# EAGLE design mm2.0 (EAGLE 8.3.2)
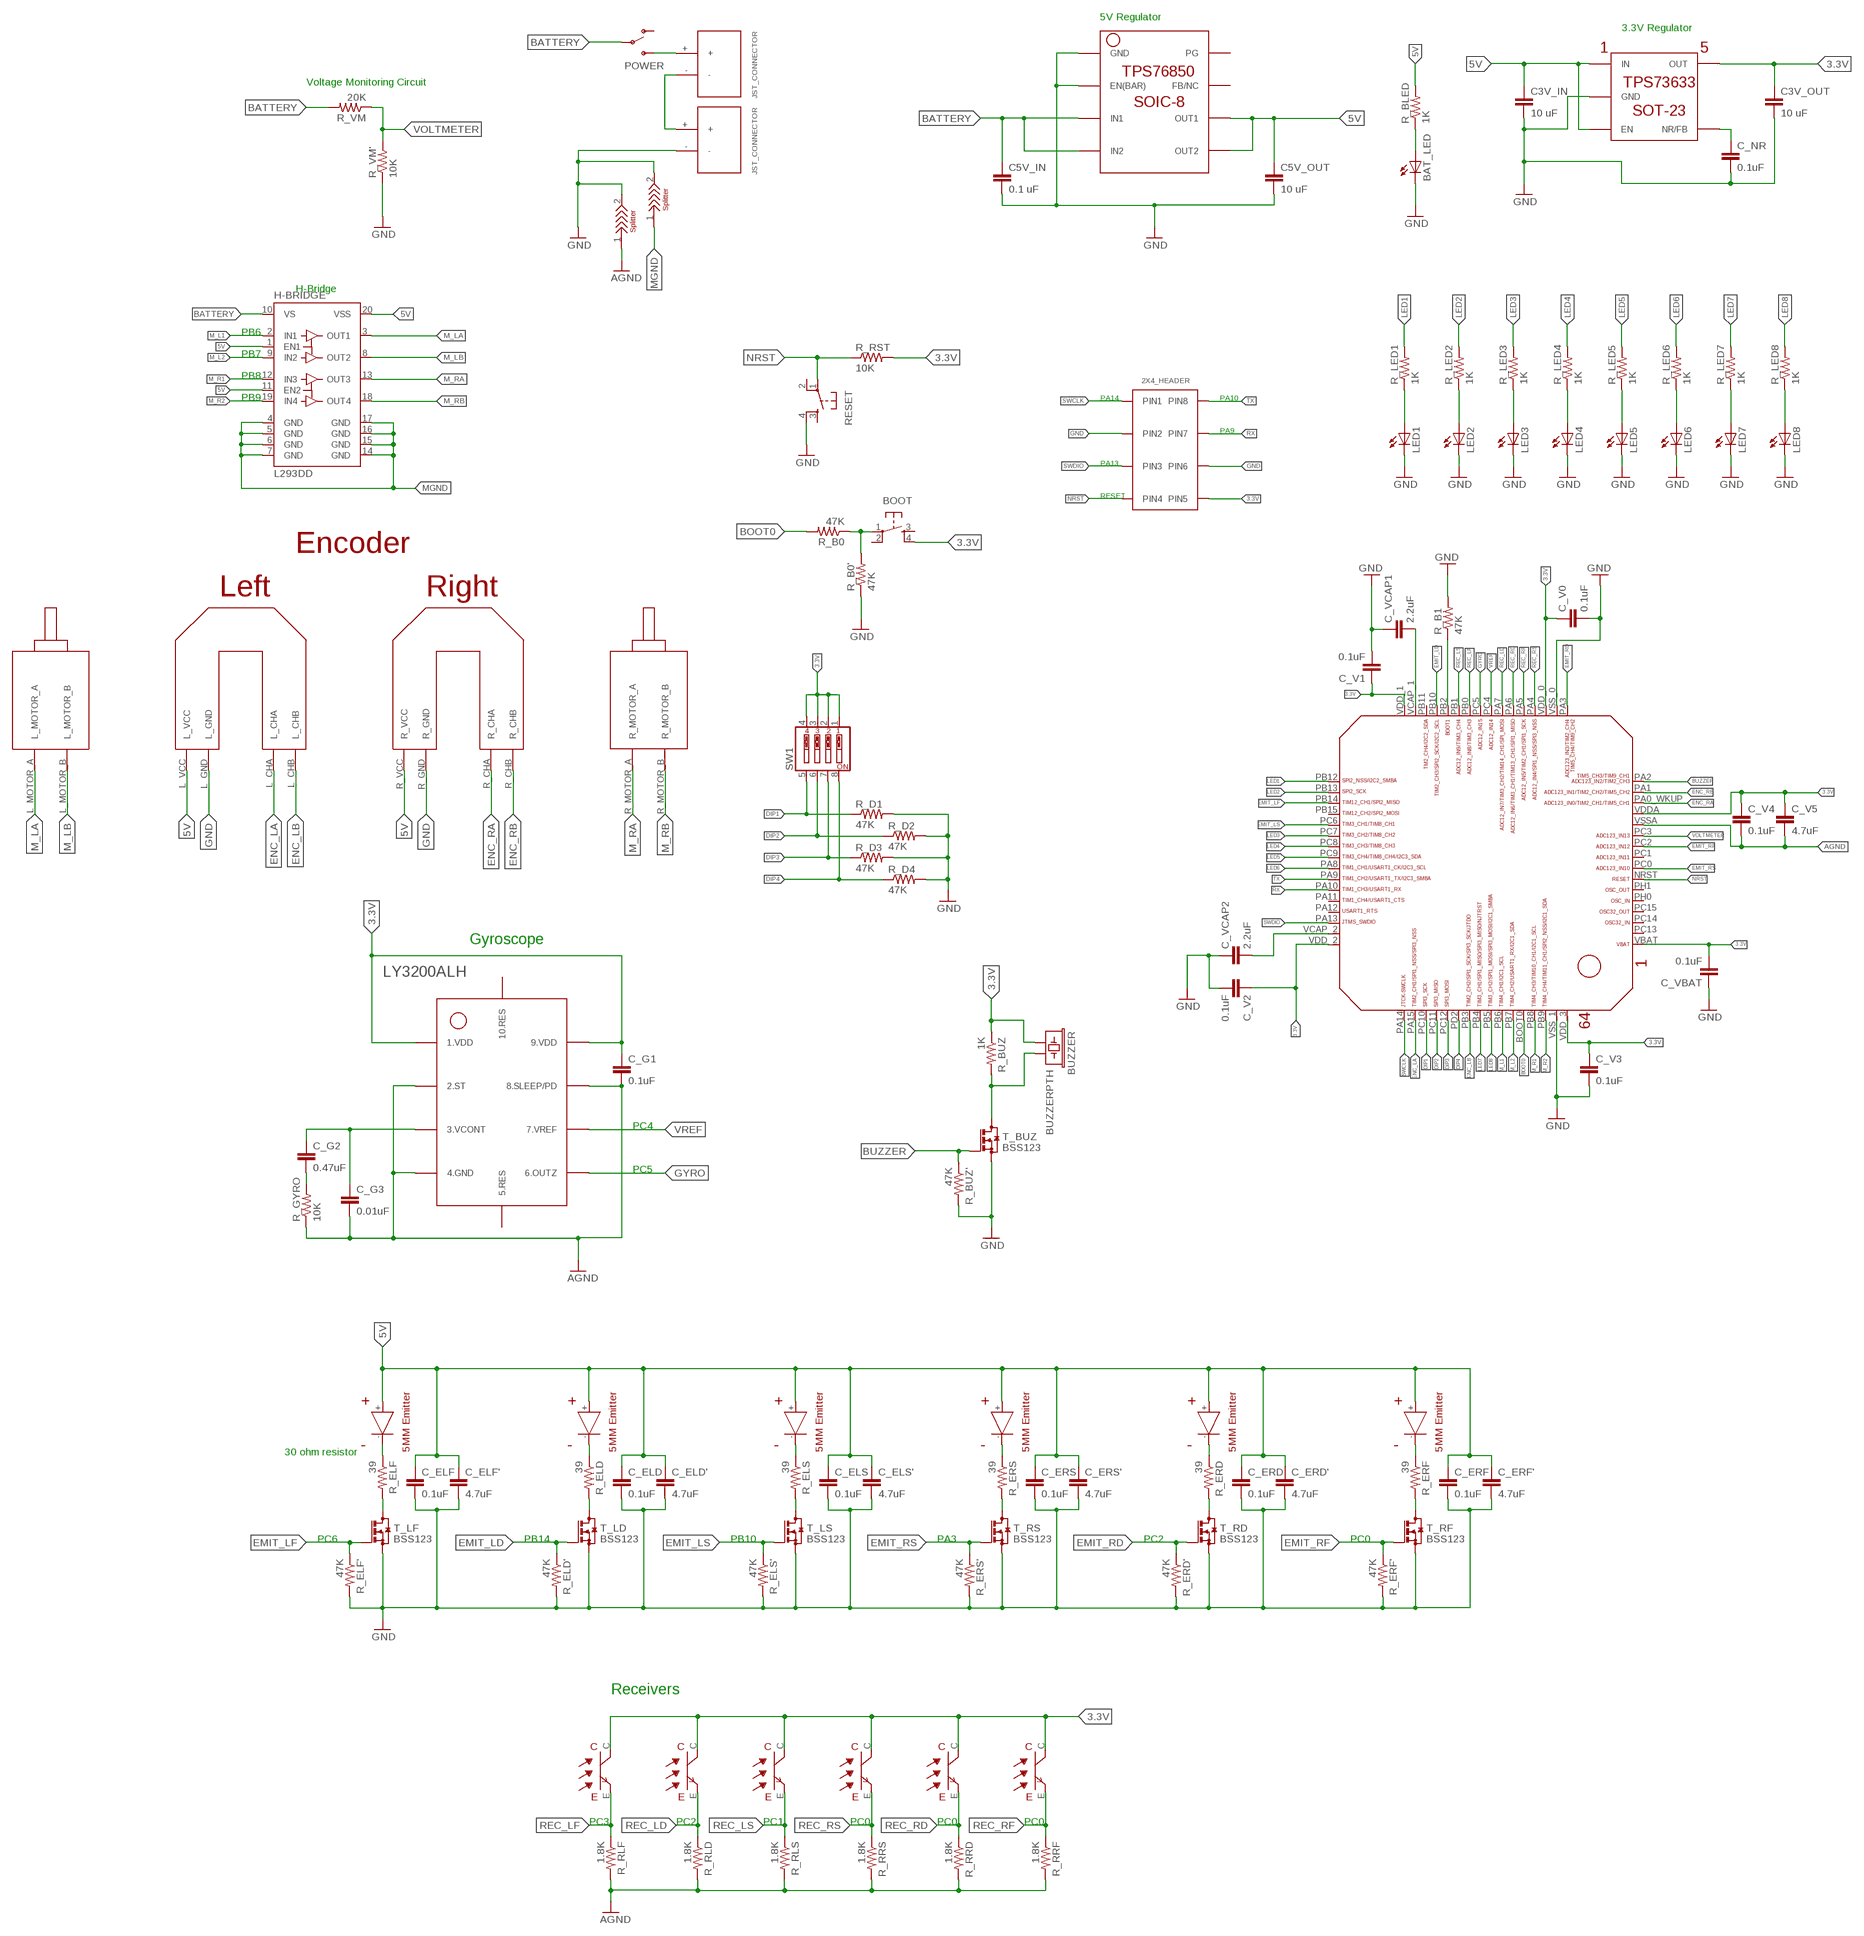
[diagram p0: schematic, sheet 1]

## Parts
BAT_LED  LED1206  [LED-1206]
BOOT  TAC_SWITCHPTH  [TACTILE-PTH]
BUZZER  BUZZERPTH  [BUZZER-12MM]
C3V_IN  10 uF  CAP0603-CAP  [0603-CAP]
C3V_OUT  10 uF  CAP0603-CAP  [0603-CAP]
C5V_IN  0.1 uF  CAP0603-CAP  [0603-CAP]
C5V_OUT  10 uF  CAP0603-CAP  [0603-CAP]
C_ELD  0.1uF  CAP0603-CAP  [0603-CAP]
C_ELD'  4.7uF  CAP0603-CAP  [0603-CAP]
C_ELF  0.1uF  CAP0603-CAP  [0603-CAP]
C_ELF'  4.7uF  CAP0603-CAP  [0603-CAP]
C_ELS  0.1uF  CAP0603-CAP  [0603-CAP]
C_ELS'  4.7uF  CAP0603-CAP  [0603-CAP]
C_ERD  0.1uF  CAP0603-CAP  [0603-CAP]
C_ERD'  4.7uF  CAP0603-CAP  [0603-CAP]
C_ERF  0.1uF  CAP0603-CAP  [0603-CAP]
C_ERF'  4.7uF  CAP0603-CAP  [0603-CAP]
C_ERS  0.1uF  CAP0603-CAP  [0603-CAP]
C_ERS'  4.7uF  CAP0603-CAP  [0603-CAP]
C_G1  0.1uF  CAP0603-CAP  [0603-CAP]
C_G2  0.47uF  CAP0603-CAP  [0603-CAP]
C_G3  0.01uF  CAP0603-CAP  [0603-CAP]
C_NR  0.1uF  CAP0603-CAP  [0603-CAP]
C_V0  0.1uF  CAP0603-CAP  [0603-CAP]
C_V1  0.1uF  CAP0603-CAP  [0603-CAP]
C_V2  0.1uF  CAP0603-CAP  [0603-CAP]
C_V3  0.1uF  CAP0603-CAP  [0603-CAP]
C_V4  0.1uF  CAP0603-CAP  [0603-CAP]
C_V5  4.7uF  CAP0603-CAP  [0603-CAP]
C_VBAT  0.1uF  CAP0603-CAP  [0603-CAP]
C_VCAP1  2.2uF  CAP0603-CAP  [0603-CAP]
C_VCAP2  2.2uF  CAP0603-CAP  [0603-CAP]
H-BRIDGE  L293DD  [SO20]
IR_LD  EMITTER  [EMITTER]
IR_LF  EMITTER  [EMITTER]
IR_LS  EMITTER  [EMITTER]
IR_RD  EMITTER  [EMITTER]
IR_RF  EMITTER  [EMITTER]
IR_RS  EMITTER  [EMITTER]
JST  A  JST_CONNECTOR_FEMALE  [JST_CONNECTOR_FEMALE]
LED1  LEDSML0603  [SML0603]
LED2  LEDSML0603  [SML0603]
LED3  LEDSML0603  [SML0603]
LED4  LEDSML0603  [SML0603]
LED5  LEDSML0603  [SML0603]
LED6  LEDSML0603  [SML0603]
LED7  LEDSML0603  [SML0603]
LED8  LEDSML0603  [SML0603]
MCU/BLU  2X3_HEADER  [2X3_HEADER]
POWER  SWITCH-SPDTPTH  [SWITCH-SPDT]
R_B0  47K  RESISTOR0603  [0603-RES]
R_B0'  47K  RESISTOR0603  [0603-RES]
R_B1  47K  RESISTOR0603  [0603-RES]
R_BLED  1K  RESISTOR0603  [0603-RES]
R_BUZ  1K  RESISTOR0603  [0603-RES]
R_BUZ'  47K  RESISTOR0603  [0603-RES]
R_D1  47K  RESISTOR0603  [0603-RES]
R_D2  47K  RESISTOR0603  [0603-RES]
R_D3  47K  RESISTOR0603  [0603-RES]
R_D4  47K  RESISTOR0603  [0603-RES]
R_ELD  39  RESISTOR0603  [0603-RES]
R_ELD'  47K  RESISTOR0603  [0603-RES]
R_ELF  39  RESISTOR0603  [0603-RES]
R_ELF'  47K  RESISTOR0603  [0603-RES]
R_ELS  39  RESISTOR0603  [0603-RES]
R_ELS'  47K  RESISTOR0603  [0603-RES]
R_ERD  39  RESISTOR0603  [0603-RES]
R_ERD'  47K  RESISTOR0603  [0603-RES]
R_ERF  39  RESISTOR0603  [0603-RES]
R_ERF'  47K  RESISTOR0603  [0603-RES]
R_ERS  39  RESISTOR0603  [0603-RES]
R_ERS'  47K  RESISTOR0603  [0603-RES]
R_GYRO  10K  RESISTOR0603  [0603-RES]
R_LED1  1K  RESISTOR0603  [0603-RES]
R_LED2  1K  RESISTOR0603  [0603-RES]
R_LED3  1K  RESISTOR0603  [0603-RES]
R_LED4  1K  RESISTOR0603  [0603-RES]
R_LED5  1K  RESISTOR0603  [0603-RES]
R_LED6  1K  RESISTOR0603  [0603-RES]
R_LED7  1K  RESISTOR0603  [0603-RES]
R_LED8  1K  RESISTOR0603  [0603-RES]
R_RLD  1.8K  RESISTOR0603  [0603-RES]
R_RLF  1.8K  RESISTOR0603  [0603-RES]
R_RLS  1.8K  RESISTOR0603  [0603-RES]
R_RRD  1.8K  RESISTOR0603  [0603-RES]
R_RRF  1.8K  RESISTOR0603  [0603-RES]
R_RRS  1.8K  RESISTOR0603  [0603-RES]
R_RST  10K  RESISTOR0603  [0603-RES]
R_VM  20K  RESISTOR0603  [0603-RES]
R_VM'  10K  RESISTOR0603  [0603-RES]
REC_LD  RECEIVER  [RECEIVER]
REC_LF  RECEIVER  [RECEIVER]
REC_LS  RECEIVER  [RECEIVER]
REC_RD  RECEIVER  [RECEIVER]
REC_RF  RECEIVER  [RECEIVER]
REC_RS  RECEIVER  [RECEIVER]
RESET  TAC_SWITCHPTH  [TACTILE-PTH]
SW1  SW_DIP-4  [EDG-04]
T_BUZ  BSS123  [SOT23]
T_LD  BSS123  [SOT23]
T_LF  BSS123  [SOT23]
T_LS  BSS123  [SOT23]
T_RD  BSS123  [SOT23]
T_RF  BSS123  [SOT23]
T_RS  BSS123  [SOT23]
U$1  JST_CONNECTOR_FEMALE  [JST_CONNECTOR_FEMALE]
U$2  TPS73633(SOT-23)  [TPS73633(SOT-23)]
U$3  TPS76850(SOIC-8)  [TPS76850(SOIC-8)]
U$4  STM32F405/415_LQFP64  [STM32F405/415_LQFP64]
U$5  FUTURA_V1.0_MOTOR_MOUNT  [FUTURA_V1.0_MOTOT_MOUNT]
U$6  LY3200ALH  [LY3200ALH]
U$19  SPLITTER  [SPLITTER]
U$20  SPLITTER  [SPLITTER]

## Nets
3.3V: BOOT.4 BUZZER.+ C3V_OUT.1 C_G1.1 C_V0.1 C_V1.1 C_V2.1 C_V3.1 C_V4.1 C_V5.1 C_VBAT.2 MCU/BLU.PIN5 R_BUZ.1 R_RST.2 REC_LD.C REC_LF.C REC_LS.C REC_RD.C REC_RF.C REC_RS.C SW1.1 SW1.2 SW1.3 SW1.4 U$2.OUT U$4.VBAT U$4.VDD_0 U$4.VDD_1 U$4.VDD_2 U$4.VDD_3 U$4.VDDA U$6.1.VDD@1(1.VDD) U$6.9.VDD@2(9.VDD)
5V: C3V_IN.1 C5V_OUT.1 C_ELD'.1 C_ELD.1 C_ELF'.1 C_ELF.1 C_ELS'.1 C_ELS.1 C_ERD'.1 C_ERD.1 C_ERF'.1 C_ERF.1 C_ERS'.1 C_ERS.1 H-BRIDGE.1(EN1) H-BRIDGE.11(EN2) H-BRIDGE.20(VSS) IR_LD.+ IR_LF.+ IR_LS.+ IR_RD.+ IR_RF.+ IR_RS.+ R_BLED.2 U$2.EN U$2.IN U$3.OUT1 U$3.OUT2 U$5.L_VCC U$5.R_VCC
AGND: C_G1.2 C_G3.2 C_V4.2 C_V5.2 R_GYRO.1 R_RLD.2 R_RLF.2 R_RLS.2 R_RRD.2 R_RRF.2 R_RRS.2 U$4.VSSA U$6.2.ST U$6.4.GND U$6.8.SLEEP/PD U$19.1
BATTERY: C5V_IN.1 H-BRIDGE.10(VS) POWER.2(P) R_VM.2 U$3.IN1 U$3.IN2
BOOT0: R_B0.2 U$4.BOOT0
BUZZER: R_BUZ'.1 T_BUZ.1(G) U$4.PA2
C_NR: C_NR.1 U$2.NR/FB
DIP1: R_D1.1 SW1.5 U$4.PC10
DIP2: R_D2.1 SW1.6 U$4.PC11
DIP3: R_D3.1 SW1.7 U$4.PC12
DIP4: R_D4.1 SW1.8 U$4.PD2
EMIT_LD: R_ELD'.1 T_LD.1(G) U$4.PB10
EMIT_LF: R_ELF'.1 T_LF.1(G) U$4.PB14
EMIT_LS: R_ELS'.1 T_LS.1(G) U$4.PC6
EMIT_RD: R_ERD'.1 T_RD.1(G) U$4.PA3
EMIT_RF: R_ERF'.1 T_RF.1(G) U$4.PC2
EMIT_RS: R_ERS'.1 T_RS.1(G) U$4.PC0
ENC_LA: U$4.PA15 U$5.L_CHA
ENC_LB: U$4.PB3 U$5.L_CHB
ENC_RA: U$4.PA0_WKUP(PA0_AKUP) U$5.R_CHA
ENC_RB: U$4.PA1 U$5.R_CHB
GND: BAT_LED.C C3V_IN.2 C3V_OUT.2 C5V_IN.2 C5V_OUT.2 C_ELD'.2 C_ELD.2 C_ELF'.2 C_ELF.2 C_ELS'.2 C_ELS.2 C_ERD'.2 C_ERD.2 C_ERF'.2 C_ERF.2 C_ERS'.2 C_ERS.2 C_NR.2 C_V0.2 C_V1.2 C_V2.2 C_V3.2 C_VBAT.1 C_VCAP1.1 C_VCAP2.1 LED1.C LED2.C LED3.C LED4.C LED5.C LED6.C LED7.C LED8.C MCU/BLU.PIN2 MCU/BLU.PIN6 R_B0'.1 R_B1.2 R_BUZ'.2 R_D1.2 R_D2.2 R_D3.2 R_D4.2 R_ELD'.2 R_ELF'.2 R_ELS'.2 R_ERD'.2 R_ERF'.2 R_ERS'.2 R_VM'.1 RESET.4 T_BUZ.2(S) T_LD.2(S) T_LF.2(S) T_LS.2(S) T_RD.2(S) T_RF.2(S) T_RS.2(S) U$1.- U$2.GND U$3.EN(BAR) U$3.GND U$4.VSS_0 U$4.VSS_1 U$5.L_GND U$5.R_GND U$19.2 U$20.2
GY_C-R: C_G2.2 R_GYRO.2
GYRO: U$4.PC5 U$6.6.OUTZ
IR1: IR_LF.- R_ELF.1
IR2: IR_LD.- R_ELD.1
IR3: IR_LS.- R_ELS.1
IR4: IR_RS.- R_ERS.1
IR5: IR_RD.- R_ERD.1
IR6: IR_RF.- R_ERF.1
JST: JST.- U$1.+
L1: LED1.A R_LED1.1
L2: LED2.A R_LED2.1
L3: LED3.A R_LED3.1
L4: LED4.A R_LED4.1
L5: LED5.A R_LED5.1
L6: LED6.A R_LED6.1
L7: LED7.A R_LED7.1
L8: LED8.A R_LED8.1
LED1: R_LED1.2 U$4.PB12
LED2: R_LED2.2 U$4.PB13
LED3: R_LED3.2 U$4.PC7
LED4: R_LED4.2 U$4.PC8
LED5: R_LED5.2 U$4.PC9
LED6: R_LED6.2 U$4.PA8
LED7: R_LED7.2 U$4.PB4
LED8: R_LED8.2 U$4.PB5
LEDB: BAT_LED.A R_BLED.1
M_L1: H-BRIDGE.2(IN1) U$4.PB6
M_L2: H-BRIDGE.9(IN2) U$4.PB7
M_LA: H-BRIDGE.3(OUT1) U$5.L_MOTOR_A
M_LB: H-BRIDGE.8(OUT2) U$5.L_MOTOR_B
M_R1: H-BRIDGE.12(IN3) U$4.PB8
M_R2: H-BRIDGE.19(IN4) U$4.PB9
M_RA: H-BRIDGE.13(OUT3) U$5.R_MOTOR_A
M_RB: H-BRIDGE.18(OUT4) U$5.R_MOTOR_B
MGND: H-BRIDGE.4(GND) H-BRIDGE.5(GND) H-BRIDGE.6(GND) H-BRIDGE.7(GND) H-BRIDGE.14(GND) H-BRIDGE.15(GND) H-BRIDGE.16(GND) H-BRIDGE.17(GND) U$20.1
NRST: MCU/BLU.PIN4 R_RST.1 RESET.1 U$4.NRST
PB2: R_B1.1 U$4.PB2
R_BOOT: BOOT.1 R_B0'.2 R_B0.1
REC_LD: R_RLD.1 REC_LD.E U$4.PA7
REC_LF: R_RLF.1 REC_LF.E U$4.PB0
REC_LS: R_RLS.1 REC_LS.E U$4.PB1
REC_RD: R_RRD.1 REC_RD.E U$4.PA6
REC_RF: R_RRF.1 REC_RF.E U$4.PA5
REC_RS: R_RRS.1 REC_RS.E U$4.PA4
RX: MCU/BLU.PIN7 U$4.PA10
SWCLK: MCU/BLU.PIN1 U$4.PA14
SWDIO: MCU/BLU.PIN3 U$4.PA13
SWITCH: JST.+ POWER.3(S)
T_BUZ: BUZZER.- R_BUZ.2 T_BUZ.3(D)
T_LD: R_ELD.2 T_LD.3(D)
T_LF: R_ELF.2 T_LF.3(D)
T_LS: R_ELS.2 T_LS.3(D)
T_RD: R_ERD.2 T_RD.3(D)
T_RF: R_ERF.2 T_RF.3(D)
T_RS: R_ERS.2 T_RS.3(D)
TX: MCU/BLU.PIN8 U$4.PA9
V_C1: C_VCAP1.2 U$4.VCAP_1
V_C2: C_VCAP2.2 U$4.VCAP_2
VCONT: C_G2.1 C_G3.1 U$6.3.VCONT
VOLTMETER: R_VM'.2 R_VM.1 U$4.PC3
VREF: U$4.PC4 U$6.7.VREF
Unconnected: BOOT.2 BOOT.3 POWER.1(O) RESET.2 RESET.3 U$3.FB/NC U$3.PG U$4.PA11 U$4.PA12 U$4.PB11 U$4.PB15 U$4.PC1 U$4.PC13 U$4.PC14 U$4.PC15 U$4.PH0 U$4.PH1 U$6.5.RES@1(5.RES) U$6.10.RES@2(10.RES)

## Notes on the sheet
- 5V Regulator
- 3.3V Regulator
- Voltage Monitoring Circuit
- H-Bridge
- PB6
- PB7
- PB8
- PB9 | PA14 | PA10
- PA9
- PA13
- RESET
- Gyroscope
- PC4
- PC5
- 30 ohm resistor
- PC6 | PB14 | PB10 | PA3 | PC2 | PC0
- Receivers
- PC3 | PC2 | PC1 | PC0 | PC0 | PC0

## Library data of the parts
BAT_LED = SparkFun:LED: LEDs Standard schematic elements and footprints for 5mm, 3mm, 1206, and 0603 sized LEDs. 5mm - Spark Fun Electronics SKU : COM-00529 (and others)
BOOT RESET = SparkFun-Retired:TAC_SWITCH: Momentary Switch Button commonly used for reset or general input. Spark Fun Electronics SKU : COM-00097 SMT- SWCH-08247
BUZZER = SparkFun:BUZZER: Buzzer 12mm Spark Fun Electronics SKU : Comp-Buzzer
C3V_IN C3V_OUT C5V_IN C5V_OUT C_ELD C_ELD' C_ELF C_ELF' C_ELS C_ELS' C_ERD C_ERD' C_ERF C_ERF' C_ERS C_ERS' C_G1-C_G3 C_NR C_V0 C_V1-C_V5 C_VBAT C_VCAP1 C_VCAP2 = SparkFun:CAP: Capacitor Standard 0603 ceramic capacitor, and 0.1" leaded capacitor.
H-BRIDGE = st-microelectronics:L293DD: PUSH-PULL FOUR CHANNEL DRIVER WITH DIODES Source: http://www.st.com/stonline/books/pdf/docs/1330.pdf; OC_FARNELL: unknown
IR_LD IR_LF IR_LS IR_RD IR_RF IR_RS = sfh4550 _ teft4300:EMITTER
JST U$1 = JST_CONNECTOR_FEMALE. through hole:JST_CONNECTOR_FEMALE
LED1-LED8 = led:LED: LED OSRAM: - CHIPLED LG R971, LG N971, LY N971, LG Q971, LY Q971, LO R971, LY R971 LH N974, LH R974 LS Q976, LO Q976, LY Q976 LO Q996 - Hyper CHIPLED LW Q18S LB Q993, LB Q99A, LB R99A - SideLED LS A670, LO A670, LY A670, LG A670, LP A670 LB A673, LV A673, LT A673, LW A673 LH A674 LY A675 LS A676, LA A676, LO A676, LY A676, LW A676 LS A679, LY A679, LG A679 - Hyper Micro SIDELED® LS Y876, LA Y876, LO Y876, LY Y876 LT Y87S - SmartLED LW L88C, LW L88S LB L89C, LB L89S, LG L890 LS L89K, LO L89K, LY L89K LS L896, LA L896, LO L896, LY L896 - TOPLED LS T670, LO T670, LY T670, LG T670, LP T670 LSG T670, LSP T670, LSY T670, LOP T670, LYG T670 LG T671, LOG T671, LSG T671 LB T673, LV T673, LT T673, LW T673 LH T674 LS T676, LA T676, LO T676, LY T676, LB T676, LH T676, LSB T676, LW T676 LB T67C, LV T67C, LT T67C, LS T67K, LO T67K, LY T67K, LW E67C LS E67B, LA E67B, LO E67B, LY E67B, LB E67C, LV E67C, LT E67C LW T67C LS T679, LY T679, LG T679 LS T770, LO T770, LY T770, LG T770, LP T770 LB T773, LV T773, LT T773, LW T773 LH T774 LS E675, LA E675, LY E675, LS T675 LS T776, LA T776, LO T776, LY T776, LB T776 LHGB T686 LT T68C, LB T68C - Hyper Mini TOPLED® LB M676 - Mini TOPLED Santana® LG M470 LS M47K, LO M47K, LY M47K Source: http://www.osram.convergy.de LUXEON: - LUMILED® LXK2-PW12-R00, LXK2-PW12-S00, LXK2-PW14-U00, LXK2-PW14-V00 LXK2-PM12-R00, LXK2-PM12-S00, LXK2-PM14-U00 LXK2-PE12-Q00, LXK2-PE12-R00, LXK2-PE12-S00, LXK2-PE14-T00, LXK2-PE14-U00 LXK2-PB12-K00, LXK2-PB12-L00, LXK2-PB12-M00, LXK2-PB14-N00, LXK2-PB14-P00, LXK2-PB14-Q00 LXK2-PR12-L00, LXK2-PR12-M00, LXK2-PR14-Q00, LXK2-PR14-R00 LXK2-PD12-Q00, LXK2-PD12-R00, LXK2-PD12-S00 LXK2-PH12-R00, LXK2-PH12-S00 LXK2-PL12-P00, LXK2-PL12-Q00, LXK2-PL12-R00 Source: www.luxeon.com KINGBRIGHT: KA-3528ASYC Source: www.kingbright.com
MCU/BLU = 2X4_HEADER:2X3_HEADER
POWER = SparkFun-Electromechanical:SWITCH-SPDT: SPDT Switch Simple slide switch, Spark Fun Electronics SKU : COM-00102 DPDT SMT slide switch, AYZ0202, SWCH-08179; PROD_ID: SWCH-08261
R_B0 R_B0' R_B1 R_BLED R_BUZ R_BUZ' R_D1-R_D4 R_ELD R_ELD' R_ELF R_ELF' R_ELS R_ELS' R_ERD R_ERD' R_ERF R_ERF' R_ERS R_ERS' R_GYRO R_LED1-R_LED8 R_RLD R_RLF R_RLS R_RRD R_RRF R_RRS R_RST R_VM R_VM' = SparkFun-Resistors:RESISTOR: Resistor Basic schematic elements and footprints for 0603, 1206, and PTH resistors.
REC_LD REC_LF REC_LS REC_RD REC_RF REC_RS = sfh4550 _ teft4300:RECEIVER
SW1 = special:SW_DIP-4: DIP SWITCH
T_BUZ T_LD T_LF T_LS T_RD T_RF T_RS = transistor-small-signal:BSS123: N-CHANNEL MOS FET
U$2 = TPS73633(SOT-23):TPS73633(SOT-23)
U$3 = TPS76850(SOIC-8):TPS76850(SOIC-8)
U$4 = STM32F10x F4xx:STM32F405/415_LQFP64
U$5 = Futura 1.0 motor mount template:FUTURA_V1.0_MOTOR_MOUNT
U$6 = LY3200ALH:LY3200ALH
U$19 U$20 = splitter:SPLITTER

## Board
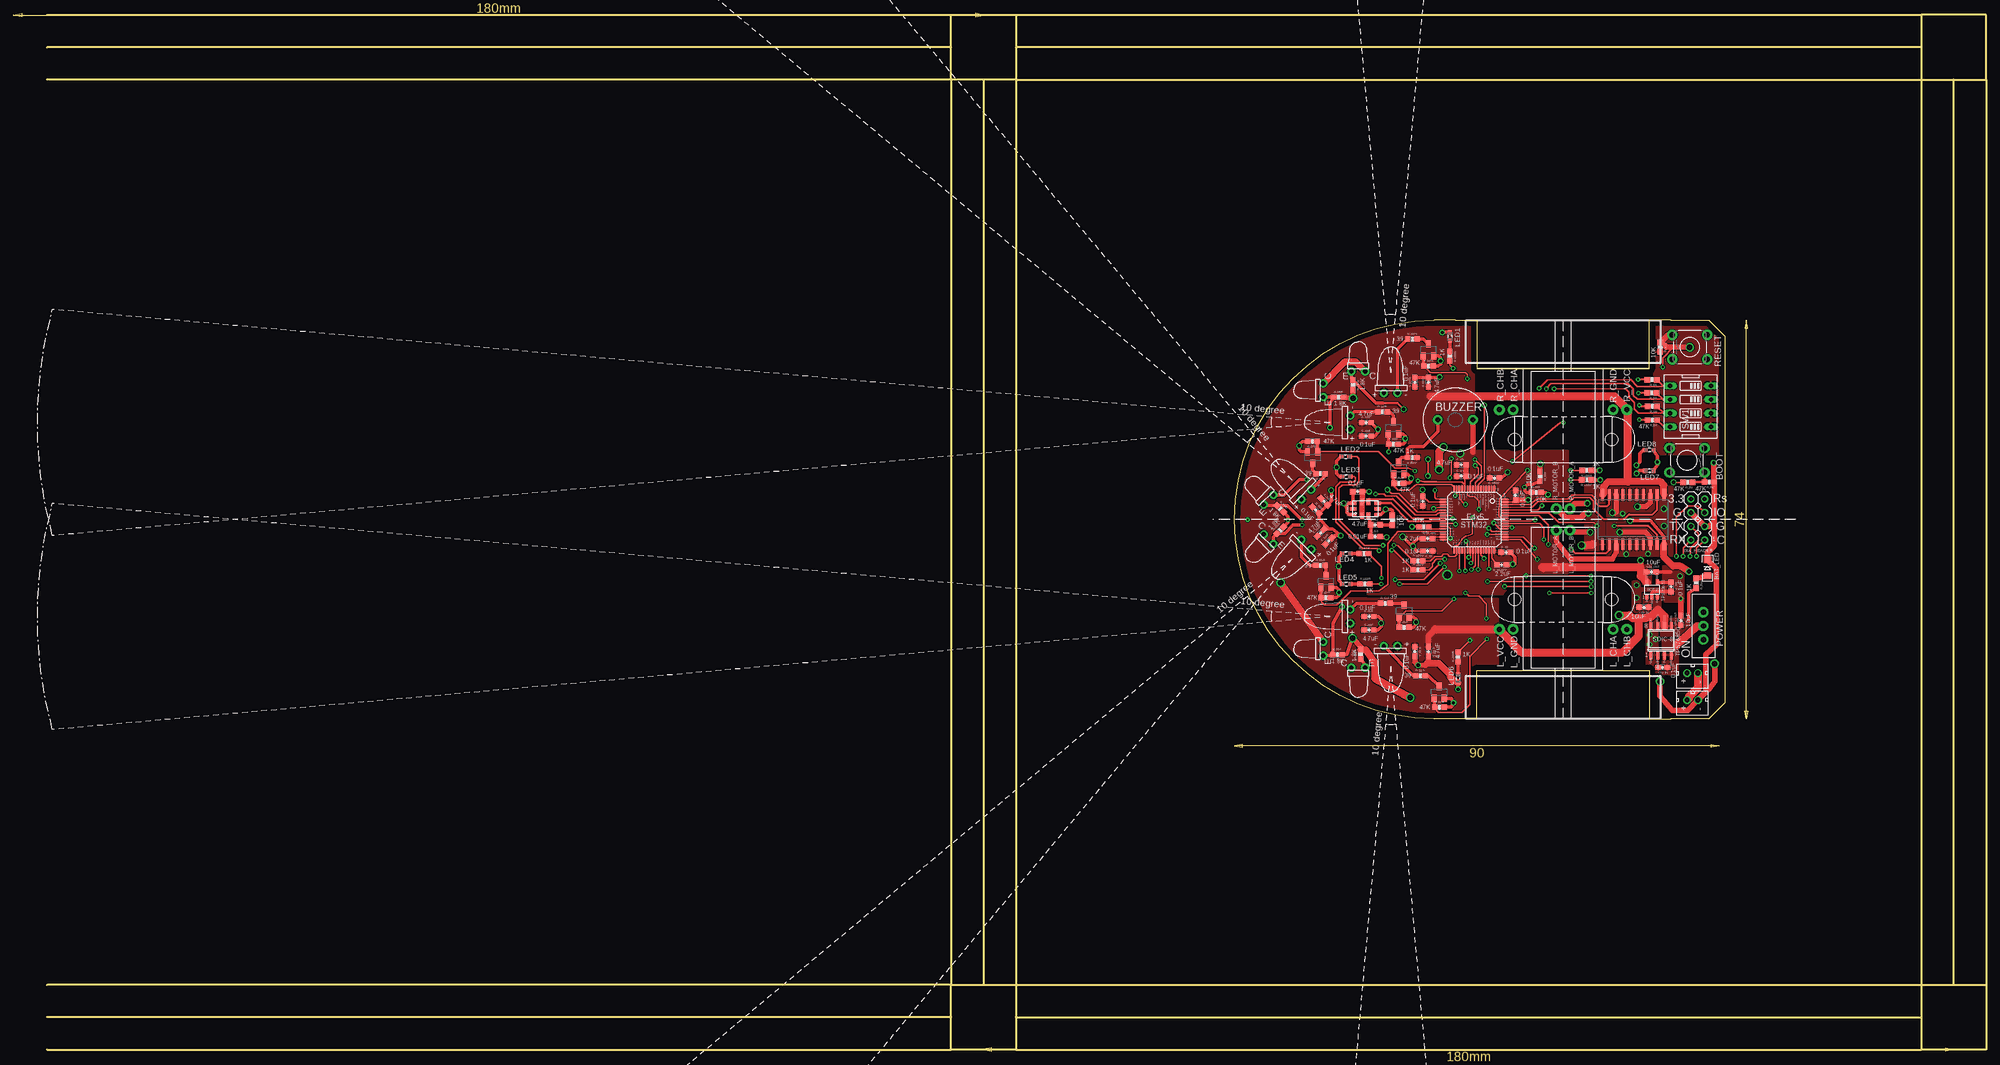
[diagram p1: board, top side]
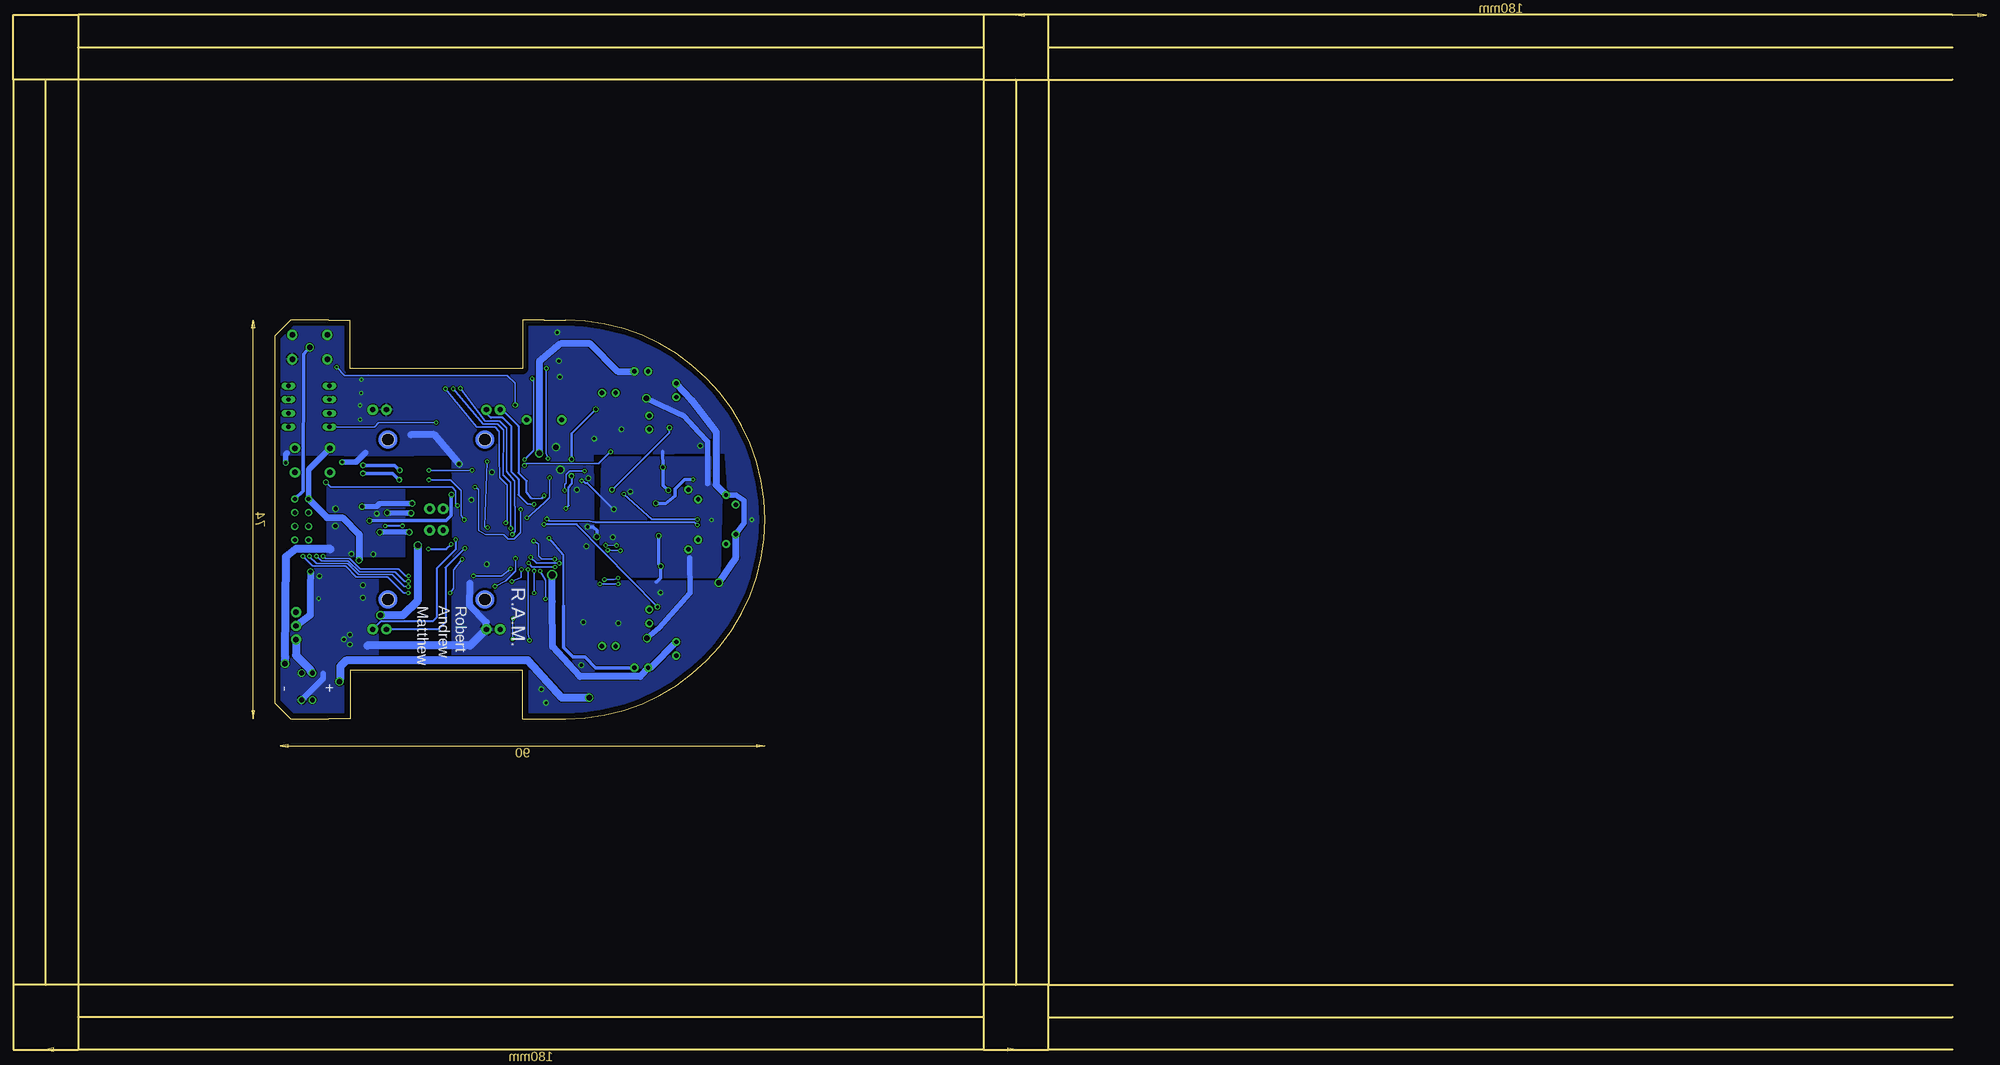
[diagram p2: board, bottom side, seen from below]

Size 359.78 x 192 mm. Coordinates in mm from the lower left corner, seen from the top.
Outline: 167.78,186 0,186
Outline: 167.78,6 0,6
Outline: 0,192 167.78,192
Outline: 167.78,192 179.78,192
Outline: 179.78,192 179.78,186
Outline: 179.78,186 179.78,180
Outline: 179.78,180 173.78,180
Outline: 173.78,180 167.78,180
Outline: 167.78,180 167.78,186
Outline: 167.78,186 167.78,192
Outline: 167.78,180 0,180
Outline: 167.78,180 167.78,12
Outline: 167.78,12 173.78,12
Outline: 173.78,12 179.78,12
Outline: 179.78,12 179.78,6
Outline: 179.78,6 179.78,0
Outline: 179.78,0 167.78,0
Outline: 167.78,0 167.78,6
Outline: 167.78,6 167.78,12
Outline: 179.78,180 179.78,12
Outline: 0,0 167.78,0
Outline: 167.78,12 0,12
Outline: 173.78,180 173.78,12
Outline: 179.78,0 347.78,0
Outline: 179.78,12 347.78,12
Outline: 347.78,12 353.78,12
Outline: 347.78,12 347.78,6
Outline: 347.78,6 347.78,0
Outline: 353.78,12 353.78,180
Outline: 179.78,180 347.78,180
Outline: 347.78,180 353.78,180
Outline: 179.78,192 347.78,192
Outline: 347.78,180 347.78,12
Outline: 347.78,192 347.78,186
Outline: 347.78,186 347.78,180
Outline: 353.78,180 359.78,180
Outline: 359.78,180 359.78,192 347.78,192
Outline: 353.78,12 359.78,12
Outline: 359.78,12 359.78,0 347.78,0
Outline: 359.78,180 359.78,12
Outline: 347.78,186 179.78,186
Outline: 179.78,6 347.78,6
Outline: 301.31,135.37 308.31,135.37 311.31,132.37 311.31,64.37 308.31,61.37 301.31,61.37
Outline: 261.31,61.37 257.31,61.37 arc-180 257.31,135.37 261.31,135.37
Copper layers (1*16): Top 0.035mm / dielectric 1.5mm / Bottom 0.035mm
Design rules "default *": minimum track width 6mil, minimum drill 0.35mm, track to track 6mil, track to pad 6mil, pad to pad 6mil, via to via 6mil, smd to smd 6mil, copper to edge 40mil, drill to drill 6mil, minimum pad ring 10mil, minimum via ring 8mil, stop-mask expansion 0mil, vias tented up to drill 0mil, thermal gap 10mil

### Footprints (pad centres in the part's own frame; a part is rotated, then mirrored left to right if it is on the bottom)
LED-1206 = smd 1.2 x 1.4: A -1.5,0; C 1.5,0
TACTILE-PTH = drill 1.016 pad 1.88: 1 -3.251,2.261; 2 3.251,2.261; 3 -3.251,-2.261; 4 3.251,-2.261
BUZZER-12MM = drill 0.9 pad 1.778: + 3.25,0; - -3.25,0
0603-CAP = smd 1.1 x 1: 1 -0.85,0; 2 0.85,0
SO20 = smd 0.6 x 2.2: 1 -5.715,-4.6; 2 -4.445,-4.6; 3 -3.175,-4.6; 4 -1.905,-4.6; 5 -0.635,-4.6; 6 0.635,-4.6; 7 1.905,-4.6; 8 3.175,-4.6; 9 4.445,-4.6; 10 5.715,-4.6; 11 5.715,4.6; 12 4.445,4.6; 13 3.175,4.6; 14 1.905,4.6; 15 0.635,4.6; 16 -0.635,4.6; 17 -1.905,4.6; 18 -3.175,4.6; 19 -4.445,4.6; 20 -5.715,4.6
EMITTER = drill 0.8 pad 1.5: + -1.27,-0.5; - 1.27,-0.5
JST_CONNECTOR_FEMALE = drill 0.889: + 0,1; - 0,-1
SML0603 = smd 0.8 x 0.8: A 0.75,0; C -0.75,0
2X3_HEADER = drill 0.8: PIN1 -1.27,3.81; PIN2 -1.27,1.27; PIN3 -1.27,-1.27; PIN4 -1.27,-3.81; PIN5 1.27,-3.81; PIN6 1.27,-1.27; PIN7 1.27,1.27; PIN8 1.27,3.81
SWITCH-SPDT = drill 1.016 pad 1.88: 1 0,2.54; 2 0,0; 3 0,-2.54
0603-RES = smd 1.1 x 1: 1 -0.85,0; 2 0.85,0
RECEIVER = drill 0.8 pad 1.5: C 1.27,-0.5; E -1.27,-0.5
EDG-04 = drill 0.813 long: 1 -3.81,-3.81; 2 -1.27,-3.81; 3 1.27,-3.81; 4 3.81,-3.81; 5 3.81,3.81; 6 1.27,3.81; 7 -1.27,3.81; 8 -3.81,3.81
SOT23 = smd 1 x 1.4: 1 -0.95,-1.1; 2 0.95,-1.1; 3 0,1.1
TPS73633(SOT-23) = smd 0.55 x 1: EN 0.95,-1.35; GND 0,-1.35; IN -0.95,-1.35; NR/FB 0.95,1.35; OUT -0.95,1.35
TPS76850(SOIC-8) = smd 0.55 x 1.5: EN(BAR) -0.635,-2.7; FB/NC -0.635,2.7; GND -1.905,-2.7; IN1 0.635,-2.7; IN2 1.905,-2.7; OUT1 0.635,2.7; OUT2 1.905,2.7; PG -1.905,2.7
STM32F405/415_LQFP64 = smd 1.2 x 0.3: BOOT0 -5.75,-1.75; PA3 5.75,-3.75; PA4 5.75,-2.25; PA5 5.75,-1.75; PA6 5.75,-1.25; PA7 5.75,-0.75; PA14 -5.75,3.75; PA15 -5.75,3.25; PB0 5.75,0.75; PB1 5.75,1.25; PB2 5.75,1.75; PB3 -5.75,0.75; PB4 -5.75,0.25; PB5 -5.75,-0.25; PB6 -5.75,-0.75; PB7 -5.75,-1.25; PB8 -5.75,-2.25; PB9 -5.75,-2.75; PB10 5.75,2.25; PB11 5.75,2.75; PC4 5.75,-0.25; PC5 5.75,0.25; PC10 -5.75,2.75; PC11 -5.75,2.25; PC12 -5.75,1.75; PD2 -5.75,1.25; VCAP_1 5.75,3.25; VDD_0 5.75,-2.75; VDD_1 5.75,3.75; VDD_3 -5.75,-3.75; VSS_0 5.75,-3.25; VSS_1 -5.75,-3.25 | smd 0.3 x 1.2: NRST -0.75,-5.75; PA0_WKUP 2.75,-5.75; PA1 3.25,-5.75; PA2 3.75,-5.75; PA8 -0.25,5.75; PA9 -0.75,5.75; PA10 -1.25,5.75; PA11 -1.75,5.75; PA12 -2.25,5.75; PA13 -2.75,5.75; PB12 3.75,5.75; PB13 3.25,5.75; PB14 2.75,5.75; PB15 2.25,5.75; PC0 -0.25,-5.75; PC1 0.25,-5.75; PC2 0.75,-5.75; PC3 1.25,-5.75; PC6 1.75,5.75; PC7 1.25,5.75; PC8 0.75,5.75; PC9 0.25,5.75; PC13 -3.25,-5.75; PC14 -2.75,-5.75; PC15 -2.25,-5.75; PH0 -1.75,-5.75; PH1 -1.25,-5.75; VBAT -3.75,-5.75; VCAP_2 -3.25,5.75; VDD_2 -3.75,5.75; VDDA 2.25,-5.75; VSSA 1.75,-5.75
FUTURA_V1.0_MOTOT_MOUNT = drill 0.95 pad 2: L_CHA -20.375,26.73; L_CHB -20.375,24.19; L_GND -20.375,45.27; L_MOTOR_A -2,37.27; L_MOTOR_B -2,34.73; L_VCC -20.375,47.81; R_CHA 20.375,45.27; R_CHB 20.375,47.81; R_GND 20.375,26.73; R_MOTOR_A 2,34.73; R_MOTOR_B 2,37.27; R_VCC 20.375,24.19 | hole 2.286: 14.85,45; 14.85,27; -14.85,27; -14.85,45
LY3200ALH = smd 0.6 x 1.2: 1.VDD@1 -1.065,2.37; 4.GND -1.065,-2.2; 5.RES@1 -0.015,-2.2; 6.OUTZ 1.035,-2.2; 9.VDD@2 1.035,2.37; 10.RES@2 -0.015,2.37 | smd 1.2 x 0.7: 2.ST -1.33,0.67; 3.VCONT -1.33,-0.5; 7.VREF 1.3,-0.5; 8.SLEEP/PD 1.3,0.67
SPLITTER = smd 0.102 x 0.102: 1 0,0; 2 0,0

### Placement (x,y rotation side)
BAT_LED  308.11,89.39 90 top
BOOT  304.31,109.37 180 top
BUZZER  261.31,116.87 0 top
C3V_IN  296.31,82.06 180 top
C3V_OUT  297.69,88.64 0 top
C5V_IN  299.81,70.92 180 top
C5V_OUT  303.15,79.61 90 top
C_ELD  237.81,94.37 45 top
C_ELD'  236.31,95.87 45 top
C_ELF  245.31,80.37 0 top
C_ELF'  245.31,77.87 0 top
C_ELS  253.81,73.87 270 top
C_ELS'  256.31,73.87 270 top
C_ERD  235.39,100.12 315 top
C_ERD'  236.99,101.7 315 top
C_ERF  244.81,113.87 0 top
C_ERF'  244.81,116.37 0 top
C_ERS  253.81,123.87 90 top
C_ERS'  256.31,123.87 90 top
C_G1  243.18,103.55 0 top
C_G2  246.47,97.37 0 top
C_G3  246.47,95.22 0 top
C_NR  301.35,85.88 270 top
C_V0  255.25,101.77 90 top
C_V1  256.19,92.52 180 top
C_V2  270.7,92.28 0 top
C_V3  272.47,102.86 270 top
C_V4  262.43,106.42 0 top
C_V5  262.41,108.54 0 top
C_VBAT  268.58,106.09 180 top
C_VCAP1  256.17,94.82 0 top
C_VCAP2  269.89,89.96 180 top
H-BRIDGE  294.31,98.37 0 top
IR_LD  233.31,93.37 135 top
IR_LF  241.31,80.37 90 top
IR_LS  249.31,74.37 180 top
IR_RD  233.31,103.37 45 top
IR_RF  241.31,116.37 90 top
IR_RS  249.31,122.37 0 top
JST  305.31,69.87 90 top
LED1  260.31,132.37 270 top
LED2  240.98,110.07 0 top
LED3  241.08,106.34 0 top
LED4  241.08,92.05 0 top
LED5  241.08,86.41 0 top
LED6  261.81,68.87 90 top
LED7  297.29,107.42 180 top
LED8  297.29,111.27 180 top
MCU/BLU  306.31,98.37 180 top
POWER  307.34,78.61 0 top
R_B0  304.44,105.27 180 top
R_B0'  308.44,105.32 180 top
R_B1  255.51,96.99 180 top
R_BLED  306.01,86.55 270 top
R_BUZ  253.31,109.87 180 top
R_BUZ'  250.85,105.1 0 top
R_D1  297.82,124.32 180 top
R_D2  297.77,121.87 180 top
R_D3  297.85,119.37 180 top
R_D4  297.85,116.82 180 top
R_ELD  236.31,89.87 0 top
R_ELD'  237.31,83.87 0 top
R_ELF  248.34,82.8 0 top
R_ELF'  251.81,78.37 0 top
R_ELS  254.81,69.37 0 top
R_ELS'  258.34,63.55 0 top
R_ERD  236.31,106.87 180 top
R_ERD'  234.81,112.87 180 top
R_ERF  247.81,118.37 0 top
R_ERF'  249.81,112.37 0 top
R_ERS  253.31,131.87 0 top
R_ERS'  256.31,126.87 0 top
R_GYRO  249.62,98.22 270 top
R_LED1  260.29,128.7 270 top
R_LED2  254.35,90.7 0 top
R_LED3  254.35,89.03 0 top
R_LED4  244.31,92.05 0 top
R_LED5  244.54,86.41 0 top
R_LED6  261.81,72.87 90 top
R_LED7  285.68,105.72 180 top
R_LED8  285.73,107.49 180 top
R_RLD  228.81,96.37 45 top
R_RLF  239.43,73.3 0 top
R_RLS  243.75,73.37 90 top
R_RRD  228.81,100.37 315 top
R_RRF  239.66,121.1 0 top
R_RRS  242.31,123.37 270 top
R_RST  299.31,130.37 270 top
R_VM  276.34,103.41 0 top
R_VM'  277,106.32 270 top
REC_LD  226.31,94.37 135 top
REC_LF  236.31,74.37 90 top
REC_LS  243.31,70.37 180 top
REC_RD  226.31,102.37 45 top
REC_RF  236.31,122.37 90 top
REC_RS  243.31,126.37 0 top
RESET  304.81,130.37 0 top
SW1  304.95,119.37 90 top
T_BUZ  250.81,107.87 0 top
T_LD  237.31,86.87 0 top
T_LF  251.81,81.37 0 top
T_LS  258.32,66.29 0 top
T_RD  234.81,109.87 180 top
T_RF  249.81,115.37 0 top
T_RS  256.31,129.87 0 top
U$1  305.31,64.87 90 top
U$2  297.81,85.37 0 top
U$3  299.5,75.89 0 top
U$4  264.81,98.37 180 top
U$5  317.31,98.37 90 top
U$6  244.69,100.37 90 top
U$19  299.26,65.62 0 top
U$20  309.5,68.27 0 top

### Tracks (layer width: path | path; a pad name or v marks a point on that pad's centre or on a via)
3.3V  (via drill 0.41, 0.61, 0.8, 1.02, 1.27)
  Top 0.61: 241.91,101.4 U$6.9.VDD@2 | 241.91,101.4 241.61,101.4 241.17,101.01 241.17,100.58 | 241.17,100.58 241.17,99.64 241.55,99.31 241.93,99.31 U$6.1.VDD@1 | C_G1.1 242.33,101.82 241.91,101.4 | REC_RD.C 229.48,102.91 232.36,105.79 v233.68,105.79 | v240.59,101.37 240.92,101.06 241.17,100.58
  Top 1.016: BUZZER.+ 264.56,110.87 | v295.7,90.78 295.7,89.22 295.63,89.48
  Top 1.27: 259.81,88.06 v259.84,88.06 | REC_LF.C v228.92,86.63 | REC_RF.C 236.84,123.64 240.84,127.63 242.82,127.63 REC_RS.C | 277.45,89.48 277.67,89.25
  Top 1.524: 295.63,89.48 277.45,89.48 | 295.7,89.22 295.7,87.88 U$2.OUT
  Bottom 0.61: v233.68,105.79 235.3,105.79 237.03,104.06 237.03,102.69 238.78,101.37 v240.59,101.37
  Bottom 1.016: REC_LD.C 224.25,97.74 224.25,101.9 225.67,102.91 REC_RD.C | MCU/BLU.PIN5 305.04,107.65 BOOT.4 | 295.68,90.8 v295.7,90.78 | 244.59,125.86 REC_RS.C
  Bottom 1.27: REC_LF.C 241.58,70.87 REC_LS.C 243.49,69.21 254.68,69.21 259.76,74.8 259.81,83.08 v259.84,88.06 | REC_LD.C 225.77,91.36 225.75,91.36 v228.92,86.63 | REC_RF.C 234.08,120.59 229.41,114.63 229.46,104.81 REC_RD.C | 295.68,90.8 295.68,95.71 295.7,95.71 298.73,98.73 301.59,98.73 MCU/BLU.PIN5 | v262.23,110.62 262.23,127.71 258.14,131.09 252.9,131.09 247.67,125.86 244.59,125.86
  pour Top: 298.22,135.25 311.15,135.25 311.15,110.41 298.22,110.41
  pour Top: 296.08,89.97 297.66,89.97 297.66,86.28 296.08,86.28
  pour Top: 245.08,111.12 282.32,111.15 282.22,84.45 244.98,84.43
5V  (via drill 1.02)
  Top 0.61: R_BLED.2 304.59,84.72 304.59,79.68
  Top 1.016: 257.55,78 256.31,76.74 C_ELS'.1
  Top 1.27: H-BRIDGE.11 300.03,104.69 299.36,105.41 293.34,105.41 289.69,105.41 288.78,104.39 288.78,103.15 H-BRIDGE.20
  Top 1.524: 257.55,78 U$5.L_VCC 270.13,77.37 270.13,77.2 273.59,73.73 292.35,73.73 295.35,76.73 295.35,80.03 295.45,80.14 | U$3.OUT1 300.13,80.4 298.93,81.61 297.58,80.26 296.94,80.26 296.82,80.14 295.45,80.14 | 295.45,80.14 294.1,80.14 293.65,80.59 v291.72,80.59 | 293.34,105.41 293.34,118.24 U$5.R_VCC 292.5,119.37 292.5,119.54 290.83,121.21 256.74,121.21 | v284.78,93.57 286.76,93.78
  Bottom 1.524: v284.78,93.57 284.83,83.29 287.53,80.59 v291.72,80.59
  pour Top: 299.44,80.14 304.75,80.14 304.75,76.6 299.44,76.63
  pour Top: 296.16,84.68 299.49,84.68 299.49,81.05 296.16,81.08
  pour Top: 285.31,104.75 289.05,104.75 289.05,91.29 285.31,91.29
  pour Top: 222.98,135.61 264.79,135.56 264.92,112.42 223.11,112.47
  pour Top: 219.45,113.61 239.37,113.61 239.21,83.18 219.3,83.18
  pour Top: 220.6,83.89 269.26,83.72 269.26,61.54 220.8,61.69
AGND  (via drill 0.35, 0.61, 1.02)
  Top 0.305: C_V4.2 263.06,105.95 U$4.VSSA 263.02,104.16 263.02,104.84 262.84,105.02 262.56,105.28 260.81,105.28 259.99,105.36 259.81,105.36 257.88,105.36
  Top 0.406: 257.88,105.36 255.5,105.33 v254.35,105.56
  Top 0.61: R_RRD.2 230.25,98.94 v230.25,98.3 230.25,97.84 R_RLD.2 | 241.67,120.87 v242.34,120.85 | R_RLF.2 241.24,73.3 v242.24,76.35 | 248.79,100.25 v248.41,100.25 | C_G3.2 246.71,95.07 v248.59,95.07 | U$6.4.GND 247.46,99.3 v248.41,100.25 | v248.41,100.25 249.37,100.25 249.6,100.02 249.6,99.1 R_GYRO.1 | U$6.8.SLEEP/PD | C_G1.2 245.09,103.55 v245.34,103.55
  Top 1.016: R_RRS.2 242.31,121.51 v242.34,120.85 | R_RRF.2 241.67,120.87 | v242.24,76.35 243.87,74.65 R_RLS.2 | U$6.8.SLEEP/PD U$6.2.ST | v299.28,68.3 299.26,67.82 299.26,66.9 U$19.1 | U$6.8.SLEEP/PD C_G1.2 | C_V5.2 C_V4.2
  Top 1.27: R_RLS.2 244.67,74.19 246.43,71.75
  Top 1.524: v252.96,65.3 246.43,68.88 246.43,71.75
  Bottom 0.406: v248.41,100.25 253.31,105.15 253.69,105.15 254.05,105.51 v254.35,105.56
  Bottom 1.016: v242.24,76.35 239.95,78.2 234.26,84.71 234.29,91.18 | v242.34,120.85 235.38,117.55 232.61,114.55 231.01,112.85 230.96,105.03 | 299.14,69.04 299.11,68.58
  Bottom 1.27: 299.11,68.58 v299.28,68.3
  Bottom 1.524: 299.14,69.04 299.14,71.12 298.07,72.2 264.33,72.25 258.02,65.3 v252.96,65.3
  pour Bottom: 230.48,109.83 250.41,109.78 250.95,87.86 228.88,87.73 228.47,103.22 230.7,105.46
BATTERY  (via drill 0.61, 0.8)
  Top 0.61: H-BRIDGE.10 300.03,95.19 297.48,98.17 v293.72,98.14 | v278.53,103 278.12,103.41 R_VM.2
  Top 1.27: H-BRIDGE.10 300.03,91.38 301.67,89.74 303.04,89.74 v304.67,88.72
  Top 1.524: POWER.2 306.15,78.54 302.33,75
  Bottom 0.61: v293.72,98.14 279.5,98.17 278.53,99.13 v278.53,103
  Bottom 1.27: v304.67,88.72 304.69,85.83 304.72,82.1 304.72,80.6 POWER.2
  pour Top: 299.82,69.75 302.56,69.75 302.56,76.02 299.82,76.02
BOOT0  (via drill 0.41, 0.61)
  Top 0.305: U$4.BOOT0 275.64,100.12 275.65,100.13 276.65,100.13 v277.39,100.94 | v301.8,105.26 303.58,105.26 R_B0.2
  Bottom 0.305: v301.8,105.26 300.94,104.39 278.41,104.39 277.72,103.68 277.72,101.34 v277.39,100.94
BUZZER
  Top 0.305: R_BUZ'.1 250,104.5 250.64,103.86 252.75,103.86 254.07,104.82 260.63,104.82 261.06,104.42 U$4.PA2
  Top 0.61: T_BUZ.1 249.86,105.24 R_BUZ'.1
C_NR
  Top 0.61: U$2.NR/FB C_NR.1
DIP1  (via drill 0.41)
  Top 0.305: v267.23,95.6 v267.24,95.62 U$4.PC10 | SW1.5 301,123.04 295.12,123.04 293.85,124.31 278.36,124.28 v276.86,122.71
  Top 0.508: R_D1.1 299.94,123.18 SW1.5
  Bottom 0.305: v267.23,95.6 267.2,95.65 266.7,96.16 266.77,105.54 268.27,107.24 268.25,115.34 269.59,116.69 272.26,116.69 v276.86,122.71
DIP2  (via drill 0.41)
  Top 0.305: v267.51,96.75 268.14,96.12 U$4.PC11 | SW1.6 301.05,120.72 295.04,120.72 294.38,121.38 294.38,122.58 293.37,123.59 279.01,123.62 v278.2,122.63
  Top 0.508: R_D2.1 299.88,120.64 SW1.6
  Bottom 0.305: v267.51,96.75 267.53,105.26 268.91,106.6 268.88,115.01 269.92,116.08 272.67,116.1 v278.2,122.63
DIP3  (via drill 0.41)
  Top 0.305: SW1.7 295.26,118.1 294.51,118.84 294.51,120.06 293.49,121.08 293.49,122.02 292.93,122.58 v279.65,122.63 | v268.45,97.74 269.57,96.62 U$4.PC12
  Top 0.508: R_D3.1 300.04,118.1 SW1.7
  Bottom 0.305: v268.45,97.74 268.19,97.99 268.22,104.8 269.62,106.12 269.69,110.08 269.67,110.95 269.67,114.68 270.43,115.54 273.86,115.57 v279.65,122.63
DIP4  (via drill 0.35, 0.41)
  Top 0.305: U$4.PD2 271.51,97.12 v271.83,96.87 | v271.9,109.12 280.77,116.36 v281.33,116.36
  Top 0.508: R_D4.1 299.96,115.58 SW1.8
  Bottom 0.305: v271.83,96.87 272.16,96.87 272.39,97.05 v271.9,109.12 | v281.33,116.36 292,116.36 292.79,115.56 SW1.8
EMIT_LD
  Top 0.305: R_ELD'.1 236.46,83.06 237.03,82.5 239.34,82.5 241.93,85.09 247.14,85.09 248.79,86.33 248.79,93.88 250.62,96.11 U$4.PB10
  Top 0.61: T_LD.1 236.36,83.97 R_ELD'.1
EMIT_LF  (via drill 0.41)
  Top 0.305: T_LF.1 251,80.27 252.12,81.38 258.82,81.38 v261.06,83.62 | U$4.PB14 262.07,92.61 v262.07,88.82
  Top 0.61: T_LF.1 250.86,78.47 R_ELF'.1
  Bottom 0.305: v261.06,83.62 261.06,87.09 v262.07,88.82
EMIT_LS  (via drill 0.35, 0.41)
  Top 0.305: T_LS.1 257.44,65.45 | v263.18,88.83 263.07,89.61 U$4.PC6 | R_ELS'.1 257.49,63.3 258.19,62.61 262.53,62.61 263.98,64.06 263.98,73 v267.15,76.17 | v267.1,79.98 267.1,82.73 265.68,84.15 263.8,84.15 v263.19,84.76
  Top 0.61: T_LS.1 257.39,63.65 R_ELS'.1
  Bottom 0.305: v267.15,76.17 267.15,79.93 v267.1,79.98 | v263.19,84.76 263.19,88.81 v263.18,88.83
EMIT_RD  (via drill 0.41)
  Top 0.305: T_RD.1 247.04,110.97 250.11,107.9 252.57,107.9 v253.82,107.36 | v257.53,103.78 257.53,102.41 257.81,102.13 259.05,102.13 U$4.PA3
  Top 0.61: R_ERD'.1 235.76,112.77 T_RD.1
  Bottom 0.305: v253.82,107.36 256.56,107.36 257.22,106.75 257.22,105.15 257.53,104.85 v257.53,103.78
EMIT_RF  (via drill 0.41)
  Top 0.305: U$4.PC2 264.06,105.31 265.55,106.81 265.55,107.82 v264.97,108.41 | v248.97,110.95 R_ERF'.1
  Top 0.61: T_RF.1 248.86,112.47 R_ERF'.1
  Bottom 0.305: v264.97,108.41 264.64,108.74 251.18,108.74 v248.97,110.95
EMIT_RS  (via drill 0.41)
  Top 0.305: R_ERS'.1 256.7,125.63 263.19,125.63 263.55,125.27 v263.55,124.51 | U$4.PC0 265.06,105.22 266.14,106.3 266.14,108.29 v264.94,109.49
  Top 0.61: T_RS.1 255.36,126.97 R_ERS'.1
  Bottom 0.305: v264.94,109.49 263.29,111.14 263.29,124.26 v263.55,124.51
ENC_LA  (via drill 0.41)
  Top 0.305: U$4.PA15 273.94,95.12 v276.02,93.04
  Bottom 0.406: U$5.L_CHA 280.96,77.99 279.62,79.32 279.62,89.43 v276.02,93.04
ENC_LB  (via drill 0.41)
  Top 0.305: U$4.PB3 276.96,97.61 277.75,96.82 v277.75,94.66
  Bottom 0.406: v277.75,94.66 277.75,92.78 281.25,89.28 281.25,80.21 281.99,79.47 291.64,79.47 U$5.L_CHB
ENC_RA  (via drill 0.41)
  Top 0.305: U$4.PA0_WKUP 262.14,102.17 262.84,101.47 263.01,101.37 v263.19,101.19
  Bottom 0.406: U$5.R_CHA 272.06,118.73 272.06,118.08 271.22,117.24 269.03,117.24 267.38,115.59 267.38,107.19 266.06,105.87 266.06,102.94 264.49,101.37 v263.19,101.19
ENC_RB  (via drill 0.41)
  Top 0.305: v261.31,102.79 261.56,103.18 U$4.PA1
  Bottom 0.406: v261.31,102.79 261.67,102.33 263.62,102.31 264.59,103.45 264.56,105.54 266.06,107.03 266.06,115.7 269.11,118.74 U$5.R_CHB
GND  (via drill 0.35, 0.41, 0.61, 0.76, 1.02)
  Top 0.305: 255.25,103.85 v255.27,103.91 | U$4.VSS_0 256.41,101.62 C_V0.2 | U$4.VSS_1 272.51,101.62 C_V3.2
  Top 0.406: v303.14,83.69 v303.15,83.69 | R_D1.2 295.62,124.32 v295.22,124.31 | R_D2.2 v295.3,121.87 | R_D3.2 295.61,119.37 v295.42,119.56 | R_D4.2 295.52,116.82 v295.45,116.89
  Top 0.508: C_V0.2 255.25,103.85 | 254.62,97.03 v253.26,97.03 | C_V1.2 255.5,92.42 254.2,92.4
  Top 0.61: U$2.GND 297.81,84.76 298.09,85.04 C_NR.2 | 301.29,88.64 C3V_OUT.2 | C_ERS.2 C_ERS'.2 258.29,124.72 v258.39,124.81 | 257.26,126.97 R_ERS'.2 258.08,126.87 258.59,127.2 v258.59,127.79 258.57,128.42 258.07,128.77 T_RS.2 257.27,128.78 | LED1.C 258.95,133.12 v258.9,133.07 | 259.29,63.65 R_ELS'.2 259.94,63.55 260.55,63.55 260.73,63.83 v260.96,64.34 260.63,65.2 259.28,65.2 T_LS.2 | LED6.C 261.81,67.29 v261.82,66.85 | 256.31,72.09 256.07,71.75 | T_LF.2 253.53,80.24 254.05,79.83 v254.05,79.32 254.02,78.87 253.52,78.37 R_ELF'.2 | C_ELF.2 247.03,80.37 247.57,79.83 v247.57,79.14 247.57,78.48 246.95,77.87 C_ELF'.2 | T_LD.2 239.27,85.77 239.72,85.32 v239.72,84.81 239.72,84.3 239.29,83.87 R_ELD'.2 | C_ELD'.2 237.09,96.65 237.87,96.65 | 237.87,96.65 238.53,96.65 v240.08,95.38 238.86,95.38 238.63,95.17 238.43,94.97 C_ELD.2 | R_ERD'.2 232.98,112.87 232.36,112.39 v232.36,112.04 232.36,111.25 232.64,110.97 T_RD.2 | LED2.C 239.91,109.87 239.29,109.24 v239.29,108.05 239.29,106.93 239.85,106.37 240.56,106.37 LED3.C | R_BUZ'.2 252.78,105.1 253.11,105.43 253.11,105.99 v253.13,106.02 252.38,106.77 T_BUZ.2 | T_RF.2 251.61,114.27 252.02,113.87 252.02,113.33 v252.04,113.38 251.96,113.28 251.96,112.7 251.63,112.37 R_ERF'.2 | C_ERF'.2 245.68,116.37 v246.96,115.09 246.99,115.06 246.99,114.5 246.35,113.87 C_ERF.2 | R_B1.2 254.62,97.03 | C_VBAT.1 269.9,106.11 v271.04,107.11 | C_VCAP2.1 271.88,89.94 v271.98,90.04 272.18,90.04 272.34,90.14 272.34,91.44 C_V2.2 | C_VCAP1.1 254.28,94.79 253.46,93.98 v253.49,93.39 | LED8.C 298.8,110.17 v298.8,109.02 298.8,108.51 LED7.C | 308.38,66.86 308.43,66.88
  Top 0.61: v253.49,93.39 254.2,92.4 | 237.87,96.65 235.99,98.52 C_ERD.2 236.02,99.52 C_ERD'.2 238.27,101.78 v238.27,103.81 | LED5.C 239.67,87.07 v239.67,89.71 239.67,91.39 LED4.C | C_V3.2 | v277.09,108.66 277,108.45 | v253.49,93.39 253.31,93.39 v251.53,95.17
  Top 1.016: v303.15,83.69 C5V_OUT.2 | C_ELS.2 253.81,71.96 254.38,71.3 v254.4,71.35 255.75,71.3 256.07,71.75 | C_ELS'.2 256.31,72.09 | 307.82,66.37 308.43,66.88 | v309.27,108.89 309.29,108.87 R_B0'.1 309.34,105.26 309.34,97.99 | MCU/BLU.PIN6 MCU/BLU.PIN2 308.45,97.1 309.34,97.99 | 309.34,97.99 309.34,93.52 308.11,92.29 BAT_LED.C 309.72,89.28 309.72,75.08 307.82,73.35 307.82,66.37 | 307.82,66.37 U$1.- 306.12,64.68 306.12,64.67 304.42,62.96 301.62,62.96 300.96,63.7 300.09,64.66 U$19.2 | U$20.2 308.38,66.86 | C_V3.2 v274.8,102 | 277,108.45 R_VM'.1 | LED6.C
  Top 1.27: LED6.C 260.83,68.48 260.35,69.21 260.32,69.62 258.19,71.75 256.07,71.75
  Top 1.524: v258.31,107.62 258.31,110.95 v259.1,111.81
  Bottom 0.61: 239.31,110.97 v239.29,108.05 239.26,104.67 v238.27,103.81 | 240.51,86.76 240.43,86.76 239.67,87.53 v239.67,89.71 240.08,90.12 v240.08,95.38 | v251.53,95.17 251.53,96.32 252.19,96.98 253.21,96.98 v253.26,97.03
  Bottom 1.016: U$1.- 302.33,68.85 302.33,69.77 | v298.8,109.02 296.24,109.02 294.46,110.79 | v309.27,108.89 309.27,110.46 309.04,110.69
  Bottom 1.27: U$5.L_GND 272.04,79.3 275.18,82.43 275.05,86.51 | v277.09,108.66 281.68,114.12 286,114.12
  Bottom 1.524: U$5.L_GND 275.08,74.95 294.13,74.95
  other vias: 297.35,76.99 297.35,75.18 294.94,86.18 294.97,83.84 298.45,76.12 303.02,87.88 222.78,98.32
  pour Top: 296.74,70.03 299,70.03 298.85,79.65 296.74,79.63
  pour Top: 295.7,84.81 295.7,80.67 295.6,80.62 294.28,80.62 294.18,80.72 294.18,86.97 294.31,87.09 295.42,87.09 295.58,87.02 295.58,86.05 295.63,85.77 299.64,85.82 299.82,86.21 299.82,89.79 299.84,89.81 303.45,89.81 303.7,89.56 303.7,82.95 303.68,82.93 300.2,82.95 300.05,83.06 300,84.58 299.77,85.04 295.96,85.01
  pour Bottom: 296.06,79.96 303.02,79.96 303.02,68.43 296.06,68.43
  pour Bottom: 294.05,90.09 303.81,90.09 303.81,81.41 294.05,81.41
  pour Bottom: 292.12,90.17 311.63,90.17 311.63,61.26 292.12,61.26
  pour Bottom: 285.57,134.49 311.37,134.67 311.37,110.46 285.57,110.28
  pour Bottom: 252.24,113.49 278.35,113.49 278.2,86.94 252.09,86.94
  pour Bottom: 227.05,86.82 278.23,86.89 278.23,60.78 227.05,60.7
  pour Bottom: 224.96,110.89 285.97,110.41 285.97,134.62 224.96,135.1
  pour Bottom: 217.19,113.84 217.37,79.09 227.73,78.48 227.33,98.14 226.97,102.23 227.83,113.66
GY_C-R
  Top 0.61: C_G2.2 247.69,97.37 R_GYRO.2
GYRO
  Top 0.305: 256.79,98.12 U$4.PC5
  Top 0.406: 252.6,98.12 256.79,98.12
  Top 0.508: U$6.6.OUTZ 249.31,101.4 252.6,98.12
IR1
  Top 0.61: R_ELF.1 242.97,82.8 IR_LF.-
IR2
  Top 0.61: R_ELD.1 234.33,89.87 232.76,91.44 IR_LD.-
IR3
  Top 0.61: R_ELS.1 253.54,69.37 IR_LS.-
IR4
  Top 0.61: R_ERS.1 250.58,129.99 IR_RS.-
IR5
  Top 0.61: R_ERD.1 237.16,106.51 IR_RD.-
IR6
  Top 0.61: R_ERF.1 242.54,118.37 IR_RF.-
JST
  Top 1.524: U$1.+ 304.7,65.25 304.7,65.54 306.31,67.15 JST.-
L1
  Top 0.61: LED1.A R_LED1.1
L2  (via drill 0.41)
  Top 0.305: LED2.A 243.06,110.07 243.43,109.7 243.43,105.41 242.82,104.8 240.33,104.8 239.72,104.19 239.72,98.3 244.45,93.57 v247.9,93.57 | v249.91,93.6 250.63,93.57 R_LED2.1
  Bottom 0.305: v247.9,93.57 v249.91,93.6
L3  (via drill 0.41)
  Top 0.305: v249.53,92.69 249.92,92.61 R_LED3.1 | LED3.A 242.52,106.34 242.74,106.12 242.74,105.64 242.44,105.33 240.03,105.33 239.19,104.49 239.19,97.94 244.12,93.01 246.73,93.01 v247.16,92.58
  Bottom 0.305: v247.16,92.58 248.83,92.58 v249.53,92.69
L4
  Top 0.61: R_LED4.1 LED4.A
L5
  Top 0.61: LED5.A R_LED5.1
L6
  Top 0.61: LED6.A R_LED6.1
L7  (via drill 0.61)
  Top 0.61: LED7.A 295.48,107.42 v294.97,106.91 | v288.21,105.71 R_LED7.1
  Bottom 0.61: v294.97,106.91 289.4,106.91 v288.21,105.71
L8  (via drill 0.61)
  Top 0.61: v288.11,107.49 R_LED8.1 | LED8.A 296.18,111.27 295.52,110.62 295.52,109.02 v294.92,108.41
  Bottom 0.61: v294.92,108.41 289.02,108.41 v288.11,107.49
LED1  (via drill 0.41)
  Top 0.305: v264.51,98.68 264.49,97.81 264.49,95.71 263.78,95.38 263.3,95.3 262.56,94.76 262.18,93.98 261.72,93.52 261.29,93.52 261.06,93.3 U$4.PB12 | v260.3,106.12 260.6,106.86 v260.6,109.68 | v260.91,126.41 260.29,127.03 R_LED1.2
  Bottom 0.305: v264.51,98.68 261.34,101.47 260.27,102.46 v260.3,106.12 | v260.6,109.68 260.91,110.72 v260.91,126.41
LED2
  Top 0.305: R_LED2.2 256.72,90.7 257.55,91.54 258.72,91.54 259.13,91.95 259.81,91.95 260.25,91.51 261.18,91.51 261.56,91.92 U$4.PB13
LED3  (via drill 0.41)
  Top 0.305: R_LED3.2 256.44,89.03 257.04,89.63 257.04,90.22 257.83,91.01 v259.36,91.01 | v263.29,94.36 263.55,94.26 263.55,92.63 U$4.PC7
  Bottom 0.305: v259.36,91.01 261.79,91.01 262.35,91.57 262.35,93.8 v263.29,94.36
LED4  (via drill 0.41)
  Top 0.305: v263.8,91.36 264.06,91.62 U$4.PC8 | v258.52,90.27 255.47,87.22 v250.16,87.22 | v247.6,87.53 247.6,89.62 R_LED4.2
  Bottom 0.305: v258.52,90.27 262.76,90.27 v263.8,91.36 | v250.16,87.22 248.36,87.22 v247.6,87.53
LED5  (via drill 0.41)
  Top 0.305: R_LED5.2 246.99,86.41 v247.57,86.41 | v264.21,90.3 264.56,90.65 U$4.PC9 | v259.31,89.56 256.16,86.41 v250.97,86.41
  Bottom 0.305: v247.57,86.41 v250.97,86.41 | v259.31,89.56 263.55,89.56 v264.21,90.3
LED6  (via drill 0.41)
  Top 0.305: U$4.PA8 265.06,89.85 v264.31,89.1 | v264.03,75.94 263.43,75.33 R_LED6.2
  Bottom 0.305: v264.31,89.1 264.33,77.09 v264.03,75.94
LED7  (via drill 0.41)
  Top 0.305: v282.7,105.71 v282.7,105.72 R_LED7.2 | v276.14,98.33 275.35,98.12 U$4.PB4
  Bottom 0.305: v276.14,98.33 276.68,99.09 276.68,103.78 278.69,105.71 v282.7,105.71
LED8  (via drill 0.41)
  Top 0.305: U$4.PB5 269.78,98.62 269.41,99.03 269.44,102.18 v274.7,107.52 | v282.7,107.49 R_LED8.2
  Bottom 0.305: v282.7,107.49 274.37,107.49 v274.7,107.52
LEDB
  Top 1.016: R_BLED.1 BAT_LED.A
M_L1  (via drill 0.41)
  Top 0.305: v278.58,93.78 278.58,97.31 276.77,99.12 U$4.PB6
  Top 0.406: H-BRIDGE.2 289.87,92.69 289.25,92.07 283.61,92.07 v282.8,92.89
  Bottom 0.406: v282.8,92.89 279.47,92.89 v278.58,93.78
M_L2  (via drill 0.41)
  Top 0.305: v287.6,97.18 286.99,97.79 280.49,97.79 278.66,99.62 U$4.PB7
  Top 0.406: H-BRIDGE.9 298.76,95.5 297.1,97.15 v290.8,97.15
  Bottom 0.406: v287.6,97.18 v290.8,97.15
M_LA
  Top 0.61: 291.16,93.75 H-BRIDGE.3
  Top 1.016: U$5.L_MOTOR_A 280.04,94.3 282.65,91.06 290.47,91.06 291.16,92.3 291.16,93.75
M_LB  (via drill 0.76)
  Top 1.016: v291.82,96.01 296.57,96.01 297.48,95.02 H-BRIDGE.8 | v286.33,96.01 282.94,96.01 U$5.L_MOTOR_B
  Bottom 1.016: v286.33,96.01 v291.82,96.01
M_R1
  Top 0.305: U$4.PB8 275.6,100.64 276.66,101.7 282.54,101.7 283.28,102.44 286.26,102.44 286.89,101.81 286.89,100.33 | 298.78,102.95 H-BRIDGE.12
  Top 0.406: 286.89,100.33 288.74,98.47 292.66,98.47 293.52,99.34 297.89,99.34 298.78,100.23 298.78,102.95
M_R2
  Top 0.305: U$4.PB9 275.28,101.12 276.31,102.18 282.19,102.18 282.93,102.89 286.63,102.89 287.42,102.11 287.42,101.42 287.96,100.89 | H-BRIDGE.19
  Top 0.406: 287.96,100.89 289.53,100.89 289.86,101.22 H-BRIDGE.19
M_RA  (via drill 0.76)
  Top 1.016: U$5.R_MOTOR_A 283.46,101.37 v285.82,101.37 | H-BRIDGE.13 297.49,101.55 296.69,100.76 v295.12,100.76
  Bottom 1.016: v295.12,100.76 292.43,100.76 291.82,101.37 v285.82,101.37
M_RB  (via drill 0.76)
  Top 1.016: v290.44,99.62 290.9,99.62 291.16,99.87 291.16,102.95 H-BRIDGE.18 | v286,99.54 285.41,99.54 284.57,98.71 281.7,98.71 U$5.R_MOTOR_B
  Bottom 1.016: v286,99.54 290.37,99.54 v290.44,99.62
MGND  (via drill 0.61, 0.76, 1.02)
  Top 1.016: U$20.1 309.47,71.57 v309.39,71.63
  Bottom 1.016: 309.39,72.34 309.34,72.79
  Bottom 1.524: v309.39,71.63 309.39,72.34 | 309.34,72.79 309.19,91.49 307.29,92.96 301.09,92.96 300.96,92.84
  other vias: 292.38,99.46 293.04,91.95 300.05,97.15 300.02,100.35 297.1,91.97
  pour Top: 289.45,104.6 301.65,104.6 301.65,91.46 289.45,91.46
  pour Bottom: 287.09,104.6 301.65,104.6 301.65,91.46 287.09,91.46
NRST  (via drill 0.41, 0.61, 1.02)
  Top 0.305: v266.7,119.61 266.7,105.99 265.56,104.86 U$4.NRST | v299.82,126.64 299.82,128.37 301.77,130.33
  Top 1.016: RESET.1 300.72,132.63 R_RST.1 299.8,130.73 300.09,130.73 300.49,130.33 301.77,130.33 v304.8,130.33
  Bottom 0.305: v266.7,119.61 266.7,123.67 268.14,125.12 293.93,125.12 | 293.93,125.12 293.96,125.15 | v299.82,126.64 298.29,125.12 293.93,125.12
  Bottom 0.61: v304.8,130.33 305.91,129.03 306.04,103.68 307.58,102.19 MCU/BLU.PIN4
PB2
  Top 0.305: U$4.PB2 256.73,96.62 R_B1.1
R_BOOT
  Top 0.508: BOOT.1 307.59,107.08 R_B0'.2 305.34,105.32 R_B0.1
REC_LD  (via drill 0.41)
  Top 0.305: U$4.PA7 260.3,99.11 260.83,98.91 v260.83,98.47
  Top 0.61: REC_LD.E 227.56,95.12 R_RLD.1 229.71,95.73 231.21,97.36 v232.89,97.36
  Bottom 0.406: v232.89,97.36 233.14,97.61 233.2,97.61 233.41,97.81 251.86,97.81 252.88,98.04 260.4,98.12 v260.83,98.47
REC_LF  (via drill 0.41, 0.61)
  Top 0.305: v261.36,97.48 261.13,97.66 260.37,97.66 260.24,97.62 U$4.PB0
  Top 0.61: REC_LF.E 238.38,73.1 R_RLF.1 238.61,79.07 v240.28,82.14
  Bottom 0.406: v240.28,82.14 255.27,97.46 260.7,97.48 v261.36,97.48
REC_LS  (via drill 0.41)
  Top 0.305: v260.42,94.92 260.4,96.77 259.79,97.13 258.77,97.13 U$4.PB1
  Top 0.61: R_RLS.1 244.81,71.1 REC_LS.E
  Bottom 0.406: 257.71,82.32 257.71,91.74 v260.42,94.92
  Bottom 0.61: REC_LS.E 251.74,70.87 253.72,72.85 255.93,72.85 257.73,74.65 257.73,82.29 257.71,82.32
REC_RD  (via drill 0.41)
  Top 0.305: U$4.PA6 258.12,99.62 257.67,99.16 253.91,99.16 250.38,102.69 248.46,102.69 248.05,103.1 v246.53,103.1
  Top 0.61: REC_RD.E 225.92,100.97 R_RRD.1 230.17,100.97 232.48,98.65 v232.89,98.37
  Bottom 0.406: v246.53,103.1 241.3,98.37 v232.89,98.37
REC_RF  (via drill 0.61)
  Top 0.305: U$4.PA5 257.98,100.12 257.58,99.72 254.3,99.72 250.85,103.17 249.42,103.17 v248.71,103.88
  Top 0.61: REC_RF.E 237.97,121.1 238.3,121.1 R_RRF.1 238.07,119.98 v238.05,115.42
  Bottom 0.406: v248.71,103.88 238.07,114.53 v238.05,115.42
REC_RS  (via drill 0.41, 0.61)
  Top 0.305: U$4.PA4 258.1,100.62 v257.27,100.43
  Top 0.406: v256.23,109.55 v256.23,106.45
  Top 0.508: v251.74,118.79 250.57,119.96 247.85,119.96
  Top 0.61: REC_RS.E 242.04,124.49 R_RRS.1 246.57,119.96 247.85,119.96
  Bottom 0.305: v257.27,100.43 257.04,100.66 256.74,100.99 | 256.74,104.27 256.76,104.29
  Bottom 0.406: v256.23,106.45 256.23,104.95 256.76,104.29 | 256.74,100.99 256.74,104.27
  Bottom 0.508: v256.23,109.55 256.23,114.3 v251.74,118.79
RX  (via drill 0.41)
  Top 0.305: 305.04,91.71 v304.87,91.54 304.87,92.99 306.4,94.51 306.4,95.74 MCU/BLU.PIN7 | U$4.PA10 266.06,91.74 v266.64,91.16 | v286.53,85.9 v270.46,85.95
  Bottom 0.305: v304.87,91.54 303.5,90.17 297.79,90.17 295.9,88.32 295.76,88.19 295.76,88.18 295.57,88.19 289.56,88.19 287.27,85.9 v286.53,85.9 | v266.64,91.16 266.64,88.77 268.47,86.94 v270.46,85.95
SWCLK  (via drill 0.41)
  Top 0.305: U$4.PA14 273.4,94.62 276.27,91.24 v276.53,91.01 | v286.53,84.73 v278.76,84.73 | MCU/BLU.PIN1 306.07,93.04 v306.07,91.54
  Bottom 0.305: v306.07,91.54 304.24,89.71 303.69,89.71 | 295.94,87.73 | 295.94,87.73 295.57,87.73 290.37,87.73 287.38,84.73 v286.53,84.73 | 295.94,87.73 296.18,87.73 296.19,87.73 298.17,89.71 303.69,89.71 | 303.69,89.71 | v276.53,91.01 278.15,89.03 278.13,85.55 v278.76,84.73
SWDIO  (via drill 0.41)
  Top 0.305: v302.33,91.57 302.33,98.8 304.44,100.91 306.31,100.91 MCU/BLU.PIN3 | v267.56,89.18 U$4.PA13 | v274.44,87.91 v286.48,87.88
  Bottom 0.305: v302.33,91.57 301.85,91.13 297.37,91.11 295.46,89.2 288.31,89.2 286.99,87.88 v286.48,87.88 | v274.44,87.91 269.21,87.91 v267.56,89.18
SWITCH
  Bottom 1.524: JST.+ 304.7,70.25 304.7,70.54 307.34,73.17 POWER.3
T_BUZ
  Top 0.61: T_BUZ.3 250.81,109.39 251.3,109.88 252.45,109.88 R_BUZ.2 252.46,111.49 252.9,111.94 255.37,111.94 258.09,114.65 258.09,116.84 BUZZER.-
T_LD
  Top 0.61: T_LD.3 237.31,89.72 R_ELD.2
T_LF
  Top 0.61: R_ELF.2 251.48,82.8 T_LF.3
T_LS
  Top 0.61: T_LS.3 256.34,69.37 R_ELS.2
T_RD
  Top 0.61: T_RD.3 234.81,107.52 R_ERD.2
T_RF
  Top 0.61: R_ERF.2 249.09,118.37 249.81,117.65 T_RF.3
T_RS
  Top 0.61: R_ERS.2 255.41,131.87 T_RS.3
TX  (via drill 0.41)
  Top 0.305: 303.6,91.59 v303.58,91.57 303.58,93.09 MCU/BLU.PIN8 | U$4.PA9 265.56,89.11 v265.55,89.1 | v267.31,86.87 v286.51,86.89
  Bottom 0.305: v303.58,91.57 302.64,90.65 297.63,90.65 295.58,88.64 288.95,88.64 287.19,86.89 v286.51,86.89 | v265.55,89.1 265.55,87.58 v267.31,86.87
V_C1
  Top 0.305: U$4.VCAP_1 257.32,95.12 C_VCAP1.2
V_C2
  Top 0.305: U$4.VCAP_2 268.09,91.19 C_VCAP2.2
VCONT
  Top 0.61: C_G3.1 C_G2.1 U$6.3.VCONT
VOLTMETER  (via drill 0.41)
  Top 0.305: U$4.PC3 263.56,102.95 263.93,102.59 264.87,102.59 265.68,101.78 v265.68,100.25
  Top 0.61: 275.14,103.41 R_VM.1 274.46,103.41 274.19,103.68 274.19,104.37 v274.16,104.39 274.67,104.9 275.64,104.9 R_VM'.2
  Bottom 0.305: v265.68,100.25 265.68,95.96 266.85,94.79 268.04,94.79 268.86,95.63 272.21,95.6 273.48,96.37 273.48,103.91 v274.16,104.39
VREF
  Top 0.305: U$4.PC4 253.26,98.63 253.18,98.7
  Top 0.406: U$6.7.VREF 245.33,102.18 249.7,102.18 253.18,98.7

### Text on the board
tPlace: 39 | 1K | 10K | 47K | 0.1uF | 1.8K | 4.7uF | 1.8K | 39 | 4.7uF | 47K | 47K | 0.1uF | 47K | 1K | 4.7uF | 1K | 0.1uF | 39 | 0.1uF | 10K | 0.1uF | 1K | 47K | 47K | 47K | 4.7uF | 20K | 3.3 | Rs | 1.8K | 0.1uF | 0.1uF | 0.1uF | G | IO | 4.7uF | 10K | 47K | 1.8K | TX | G | 4.7uF | 0.01uF | 2.2uF | RX | C | 0.1uF | 0.1uF | 0.1uF | 1K | 1K | 10uF | 39 | 1K | 2.2uF | 0.1uF | 1K | 1K | 47K | 39 | 0.1uF | 10uF | 10uF | 47K | 4.7uF | 1K | 1.8K | 4.7uF | ON | 1.8K | 0.1uF | 39 | 0.1uF | 47K
bPlace: R.A.M. | Robert | Andrew | Matthew | - | +